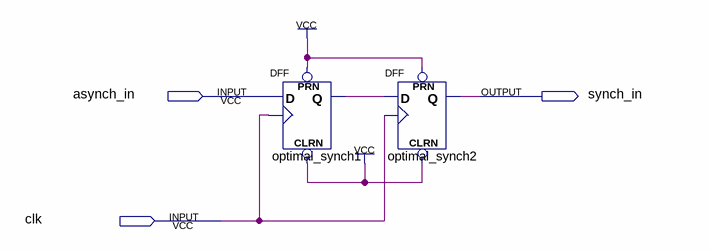
[diagram p0: schematic sheet]
// Quartus schematic optimal_synchronizer.bdf as structural Verilog: 2 symbols, 3 pins
module optimal_synchronizer (
  input  asynch_in,
  input  clk,
  output synch_in
);

  wire optimal_synch1_q;

  DFF optimal_synch1 (.CLRN(1'b1), .CLK(clk), .D(asynch_in), .PRN(1'b1), .Q(optimal_synch1_q));
  DFF optimal_synch2 (.CLRN(1'b1), .CLK(clk), .D(optimal_synch1_q), .PRN(1'b1), .Q(synch_in));
endmodule
